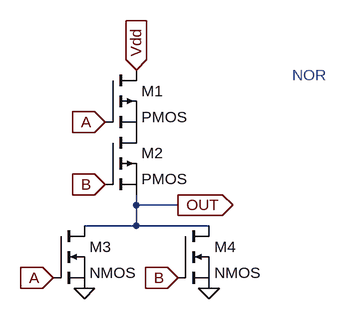
[diagram p0: schematic Draft3.asc]
Draft3.asc, the LTspice schematic file:
Version 4.1
SHEET 1 880 680
WIRE 256 272 256 256
WIRE 320 272 256 272
WIRE 256 304 256 272
WIRE 256 304 176 304
WIRE 368 304 256 304
FLAG 208 144 A
IOPIN 208 144 In
FLAG 128 384 A
IOPIN 128 384 In
FLAG 208 240 B
IOPIN 208 240 In
FLAG 320 384 B
IOPIN 320 384 In
FLAG 320 272 OUT
IOPIN 320 272 Out
FLAG 256 64 Vdd
IOPIN 256 64 In
FLAG 176 400 0
FLAG 368 400 0
SYMBOL pmos 208 64 R0
SYMATTR InstName M1
SYMBOL pmos 208 160 R0
SYMATTR InstName M2
SYMBOL nmos 128 304 R0
SYMATTR InstName M3
SYMBOL nmos 320 304 R0
SYMATTR InstName M4
TEXT 496 72 Left 2 ;NOR

The netlist it stands for:
* Draft3.asc
M1 Vdd A P001 P001 PMOS
M2 P001 B OUT OUT PMOS
M3 OUT A 0 0 NMOS
M4 OUT B 0 0 NMOS
.model NMOS NMOS
.model PMOS PMOS
.lib standard.mos
* NOR
.backanno
.end